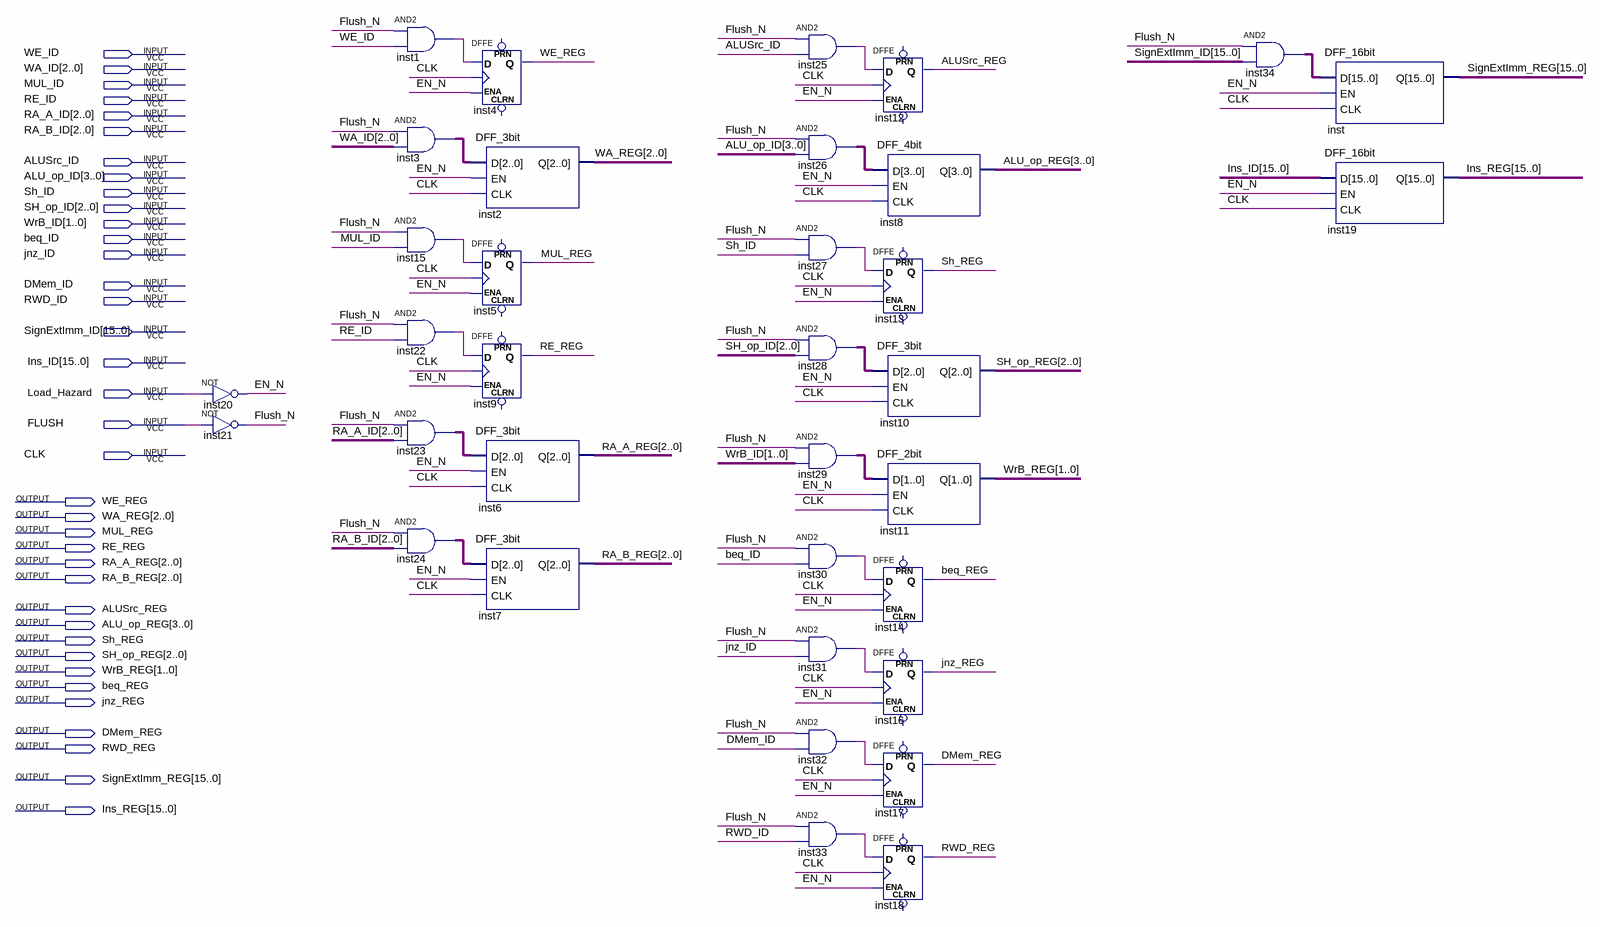
[diagram p0: schematic sheet]
// Quartus schematic ID_REG.bdf as structural Verilog: 35 symbols, 37 pins
module ID_REG (
  input  WE_ID,
  input  [2:0] WA_ID,
  input  MUL_ID,
  input  RE_ID,
  input  [2:0] RA_A_ID,
  input  [2:0] RA_B_ID,
  input  ALUSrc_ID,
  input  [3:0] ALU_op_ID,
  input  Sh_ID,
  input  [2:0] SH_op_ID,
  input  [1:0] WrB_ID,
  input  beq_ID,
  input  jnz_ID,
  input  DMem_ID,
  input  RWD_ID,
  input  [15:0] SignExtImm_ID,
  input  [15:0] Ins_ID,
  input  Load_Hazard,
  input  FLUSH,
  input  CLK,
  output WE_REG,
  output [2:0] WA_REG,
  output MUL_REG,
  output RE_REG,
  output [2:0] RA_A_REG,
  output [2:0] RA_B_REG,
  output ALUSrc_REG,
  output [3:0] ALU_op_REG,
  output Sh_REG,
  output [2:0] SH_op_REG,
  output [1:0] WrB_REG,
  output beq_REG,
  output jnz_REG,
  output DMem_REG,
  output RWD_REG,
  output [15:0] SignExtImm_REG,
  output [15:0] Ins_REG
);

  wire EN_N, Flush_N, inst1_out, inst15_out, inst22_out, inst25_out, inst27_out, inst30_out, inst31_out,
       inst32_out, inst33_out;
  wire [1:0] inst29_out;
  wire [2:0] inst3_out, inst23_out, inst24_out, inst28_out;
  wire [3:0] inst26_out;
  wire [15:0] inst34_out;

  not inst20 (EN_N, Load_Hazard);
  not inst21 (Flush_N, FLUSH);
  and inst1 (inst1_out, Flush_N, WE_ID);
  assign inst3_out = {3{Flush_N}} & WA_ID;  // AND2 inst3, 3 bits wide
  and inst15 (inst15_out, Flush_N, MUL_ID);
  and inst22 (inst22_out, Flush_N, RE_ID);
  assign inst23_out = {3{Flush_N}} & RA_A_ID;  // AND2 inst23, 3 bits wide
  assign inst24_out = {3{Flush_N}} & RA_B_ID;  // AND2 inst24, 3 bits wide
  DFFE inst4 (.D(inst1_out), .CLK(CLK), .ENA(EN_N), .Q(WE_REG));  // open: PRN, CLRN
  DFF_3bit inst2 (.D(inst3_out), .EN(EN_N), .CLK(CLK), .Q(WA_REG));
  DFFE inst5 (.D(inst15_out), .CLK(CLK), .ENA(EN_N), .Q(MUL_REG));  // open: PRN, CLRN
  DFFE inst9 (.D(inst22_out), .CLK(CLK), .ENA(EN_N), .Q(RE_REG));  // open: PRN, CLRN
  DFF_3bit inst6 (.D(inst23_out), .EN(EN_N), .CLK(CLK), .Q(RA_A_REG));
  DFF_3bit inst7 (.D(inst24_out), .EN(EN_N), .CLK(CLK), .Q(RA_B_REG));
  and inst25 (inst25_out, Flush_N, ALUSrc_ID);
  assign inst26_out = {4{Flush_N}} & ALU_op_ID;  // AND2 inst26, 4 bits wide
  and inst27 (inst27_out, Flush_N, Sh_ID);
  assign inst28_out = {3{Flush_N}} & SH_op_ID;  // AND2 inst28, 3 bits wide
  assign inst29_out = {2{Flush_N}} & WrB_ID;  // AND2 inst29, 2 bits wide
  and inst30 (inst30_out, Flush_N, beq_ID);
  and inst31 (inst31_out, Flush_N, jnz_ID);
  and inst32 (inst32_out, Flush_N, DMem_ID);
  and inst33 (inst33_out, Flush_N, RWD_ID);
  DFFE inst12 (.D(inst25_out), .CLK(CLK), .ENA(EN_N), .Q(ALUSrc_REG));  // open: PRN, CLRN
  DFF_4bit inst8 (.D(inst26_out), .EN(EN_N), .CLK(CLK), .Q(ALU_op_REG));
  DFFE inst13 (.D(inst27_out), .CLK(CLK), .ENA(EN_N), .Q(Sh_REG));  // open: PRN, CLRN
  DFF_3bit inst10 (.D(inst28_out), .EN(EN_N), .CLK(CLK), .Q(SH_op_REG));
  DFF_2bit inst11 (.D(inst29_out), .EN(EN_N), .CLK(CLK), .Q(WrB_REG));
  DFFE inst14 (.D(inst30_out), .CLK(CLK), .ENA(EN_N), .Q(beq_REG));  // open: PRN, CLRN
  DFFE inst16 (.D(inst31_out), .CLK(CLK), .ENA(EN_N), .Q(jnz_REG));  // open: PRN, CLRN
  DFFE inst17 (.D(inst32_out), .CLK(CLK), .ENA(EN_N), .Q(DMem_REG));  // open: PRN, CLRN
  DFFE inst18 (.D(inst33_out), .CLK(CLK), .ENA(EN_N), .Q(RWD_REG));  // open: PRN, CLRN
  assign inst34_out = {16{Flush_N}} & SignExtImm_ID;  // AND2 inst34, 16 bits wide
  DFF_16bit inst (.D(inst34_out), .EN(EN_N), .CLK(CLK), .Q(SignExtImm_REG));
  DFF_16bit inst19 (.D(Ins_ID), .EN(EN_N), .CLK(CLK), .Q(Ins_REG));
endmodule
